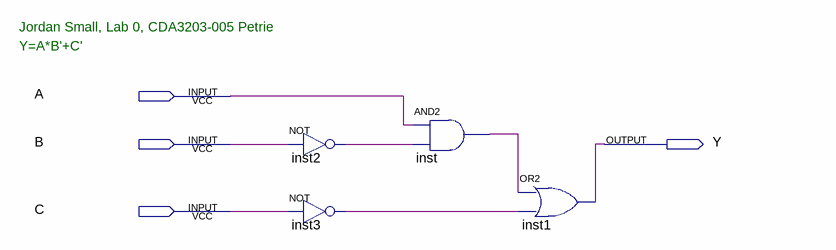
[diagram p0: schematic sheet]
// Quartus schematic Lab0-SmallJordan.bdf as structural Verilog: 4 symbols, 4 pins
module \Lab0-SmallJordan  (
  input  A,
  input  B,
  input  C,
  output Y
);

  wire inst2_out, inst3_out, inst_out;

  not inst2 (inst2_out, B);
  not inst3 (inst3_out, C);
  and inst (inst_out, A, inst2_out);
  or inst1 (Y, inst_out, inst3_out);

  // Notes on the sheet:
  //   Jordan Small, Lab 0, CDA3203-005 Petrie
  //   Y=A*B'+C'
endmodule
